# Altium schematic sheet COVER PAGE.SchDoc
size A3; DocumentNumber: 1; SheetNumber: 1; SheetTotal: 4
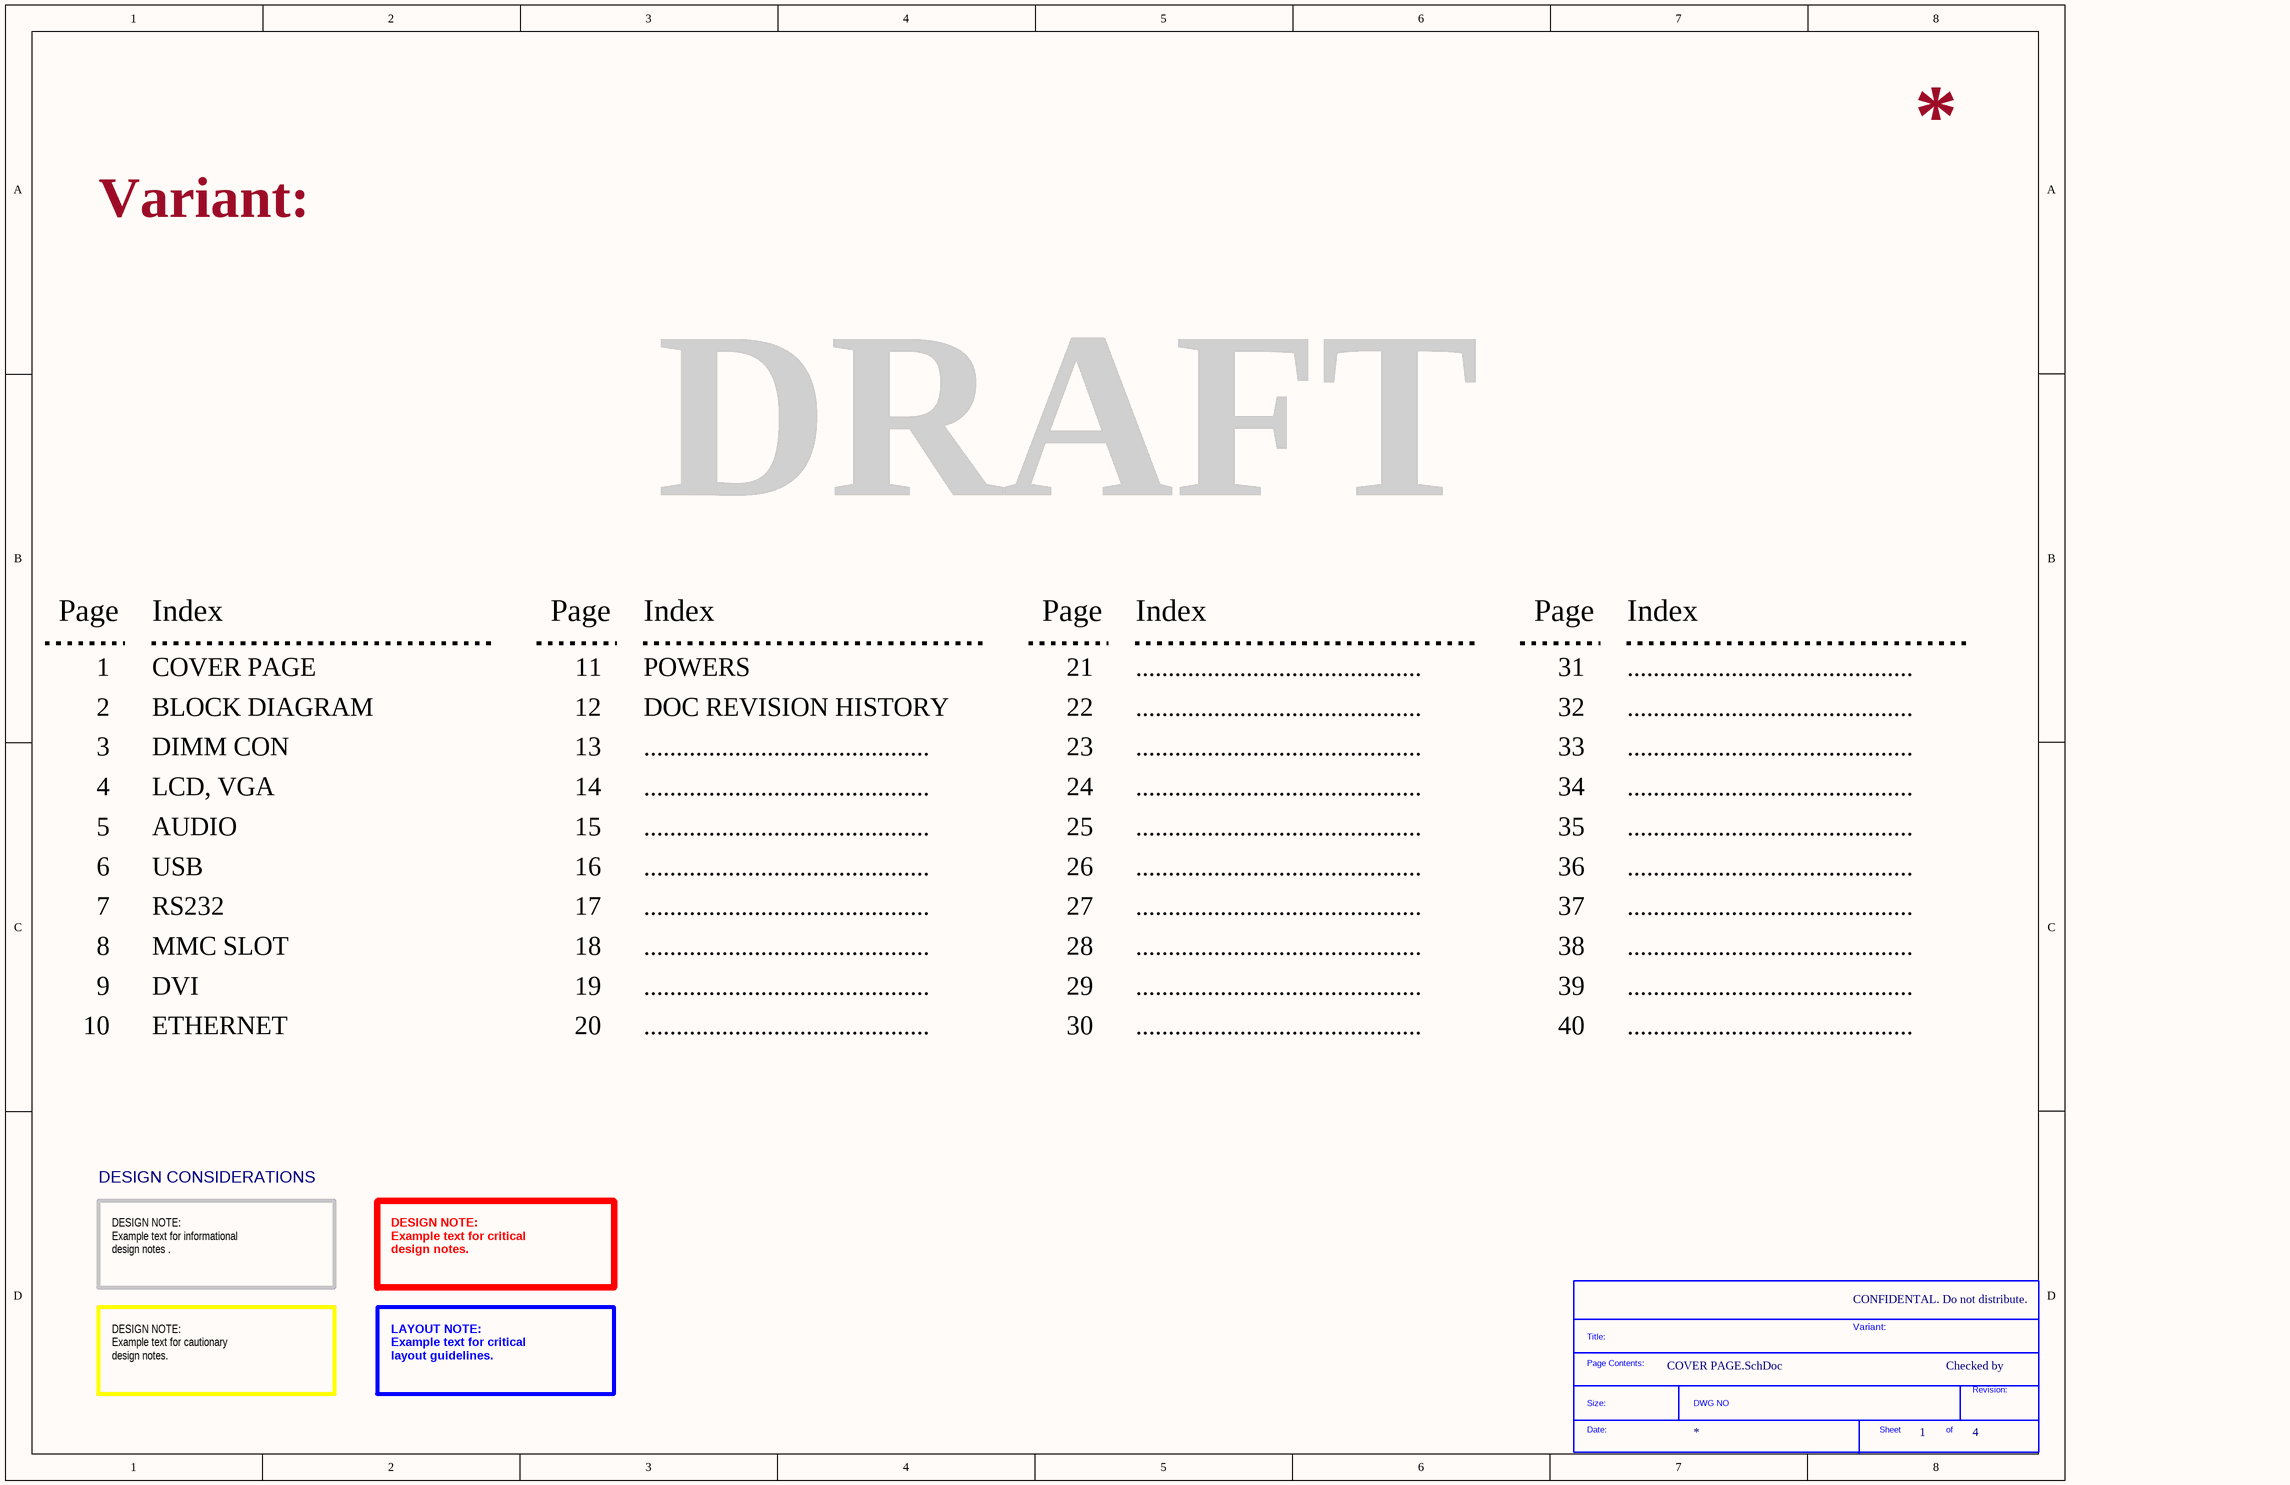
[diagram p0: COVER PAGE.SchDoc]

## Parts
*  SDTitleBlock  (value not drawn)  (graphical)

## Notes on the sheet
- Variant:
- DRAFT
- Page
- Index
- 1
- COVER PAGE
- 11
- POWERS
- 21
- ............................................
- 31
- 2
- 3
- BLOCK DIAGRAM
- DIMM CON
- 12
- 13
- DOC REVISION HISTORY
- 22
- 23
- 32
- 33
- 4
- 5
- LCD, VGA
- AUDIO
- 14
- 15
- 24
- 25
- 34
- 35
- 6
- USB
- 16
- 26
- 36
- 7
- 8
- RS232
- MMC SLOT
- 17
- 18
- 27
- 28
- 37
- 38
- 9
- 10
- DVI
- ETHERNET
- 19
- 20
- 29
- 30
- 39
- 40
- DESIGN CONSIDERATIONS
- DESIGN NOTE:
  Example text for informational
  design notes .
- DESIGN NOTE:
  Example text for critical
  design notes.
- CONFIDENTAL. Do not distribute.
- Checked by
- DESIGN NOTE:
  Example text for cautionary
  design notes.
- LAYOUT NOTE:
  Example text for critical
  layout guidelines.
- (in symbol SDTitleBlock) Title:; Page Contents:; Revision:; Size:; DWG NO; Date:; Sheet; of